# EAGLE design M207 (EAGLE 6.6.0)
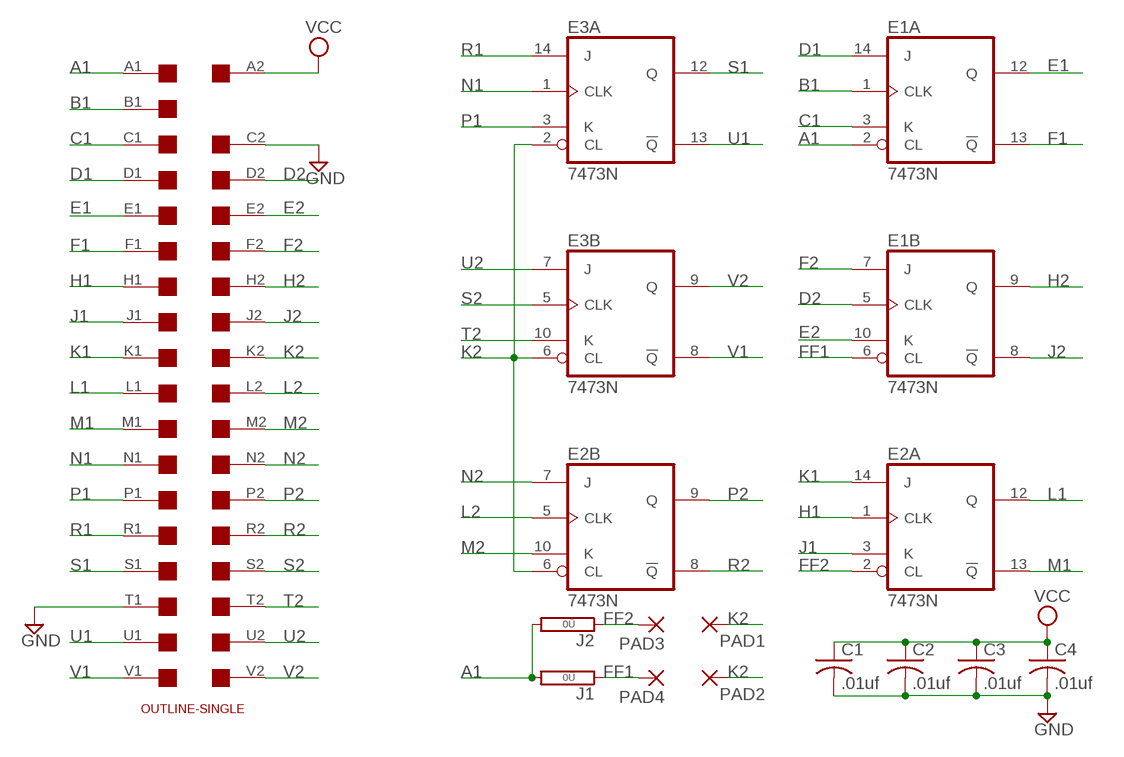
[diagram p0: schematic, sheet 1]

## Parts
C1  .01uf  C-US050-025X075  [C050-025X075]
C2  .01uf  C-US050-025X075  [C050-025X075]
C3  .01uf  C-US050-025X075  [C050-025X075]
C4  .01uf  C-US050-025X075  [C050-025X075]
E1  7473N  74LS73N  [DIL14]
E2  7473N  74LS73N  [DIL14]
E3  7473N  74LS73N  [DIL14]
J1  0R  [0R/10]
J2  0R  [0R/10]
PAD1  1,6/0,8  [1,6/0,8]
PAD2  1,6/0,8  [1,6/0,8]
PAD3  1,6/0,8  [1,6/0,8]
PAD4  1,6/0,8  [1,6/0,8]
U$1  SINGLE  [EDGE-CON2]
U$4  OUTLINE-SINGLE  [SINGLE]

## Nets
A1: E1.2(A:CL) J1.2 J2.2 U$1.A1
B1: E1.1(A:CLK) U$1.B1
C1: E1.3(A:K) U$1.C1
D1: E1.14(A:J) U$1.D1
D2: E1.5(B:CLK) U$1.D2
E1: E1.12(A:Q) U$1.E1
E2: E1.10(B:K) U$1.E2
F1: E1.13(A:!Q) U$1.F1
F2: E1.7(B:J) U$1.F2
FF1: E1.6(B:CL) J1.1 PAD4.1(P)
FF2: E2.2(A:CL) J2.1 PAD3.1(P)
GND: C1.2 C2.2 C3.2 C4.2 U$1.C2 U$1.T1
H1: E2.1(A:CLK) U$1.H1
H2: E1.9(B:Q) U$1.H2
J1: E2.3(A:K) U$1.J1
J2: E1.8(B:!Q) U$1.J2
K1: E2.14(A:J) U$1.K1
K2: E2.6(B:CL) E3.2(A:CL) E3.6(B:CL) PAD1.1(P) PAD2.1(P) U$1.K2
L1: E2.12(A:Q) U$1.L1
L2: E2.5(B:CLK) U$1.L2
M1: E2.13(A:!Q) U$1.M1
M2: E2.10(B:K) U$1.M2
N1: E3.1(A:CLK) U$1.N1
N2: E2.7(B:J) U$1.N2
P1: E3.3(A:K) U$1.P1
P2: E2.9(B:Q) U$1.P2
R1: E3.14(A:J) U$1.R1
R2: E2.8(B:!Q) U$1.R2
S1: E3.12(A:Q) U$1.S1
S2: E3.5(B:CLK) U$1.S2
T2: E3.10(B:K) U$1.T2
U1: E3.13(A:!Q) U$1.U1
U2: E3.7(B:J) U$1.U2
V1: E3.8(B:!Q) U$1.V1
V2: E3.9(B:Q) U$1.V2
VCC: C1.1 C2.1 C3.1 C4.1 U$1.A2
Unconnected: U$1.B2

## Power pins joined to a net without a drawn wire
GND: E1.11(P:GND) E2.11(P:GND) E3.11(P:GND)
VCC: E1.4(P:VCC) E2.4(P:VCC) E3.4(P:VCC)

## Library data of the parts
C1-C4 = rcl:C-US: CAPACITOR, American symbol
E1-E3 = 74xx-us:74*73: Dual J-K FLIP FLOP, clear
J1 J2 = jumper:0R: Bridge 0R 10mm
PAD1-PAD4 = wirepad:1,6/0,8: THROUGH-HOLE PAD
U$1 = dec-con:SINGLE: Single-Height DEC board
U$4 = dec-con:OUTLINE-*: Board outlines for DEC boards.

## Board
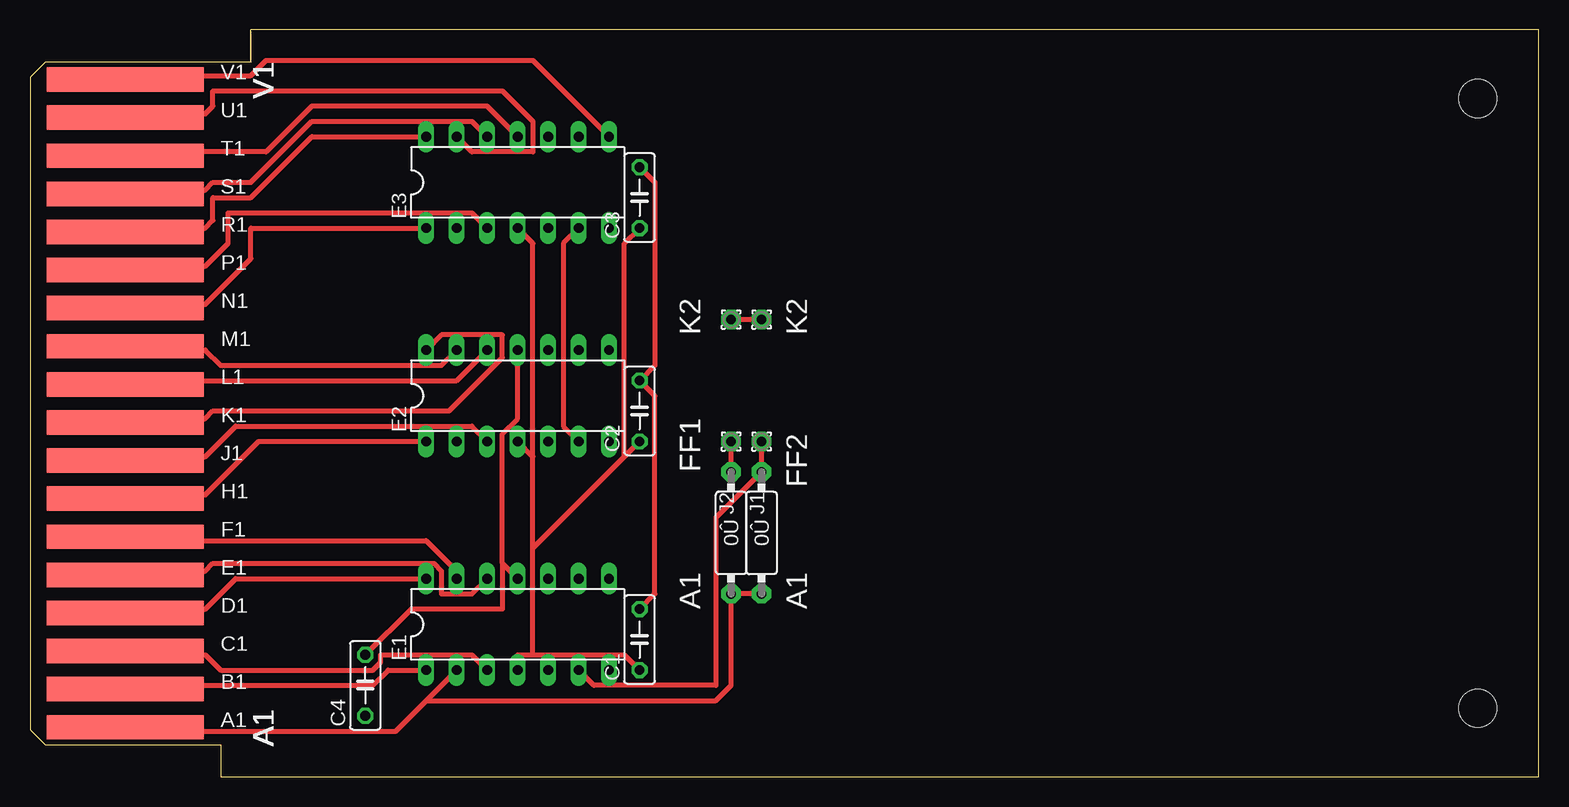
[diagram p1: board, top side]
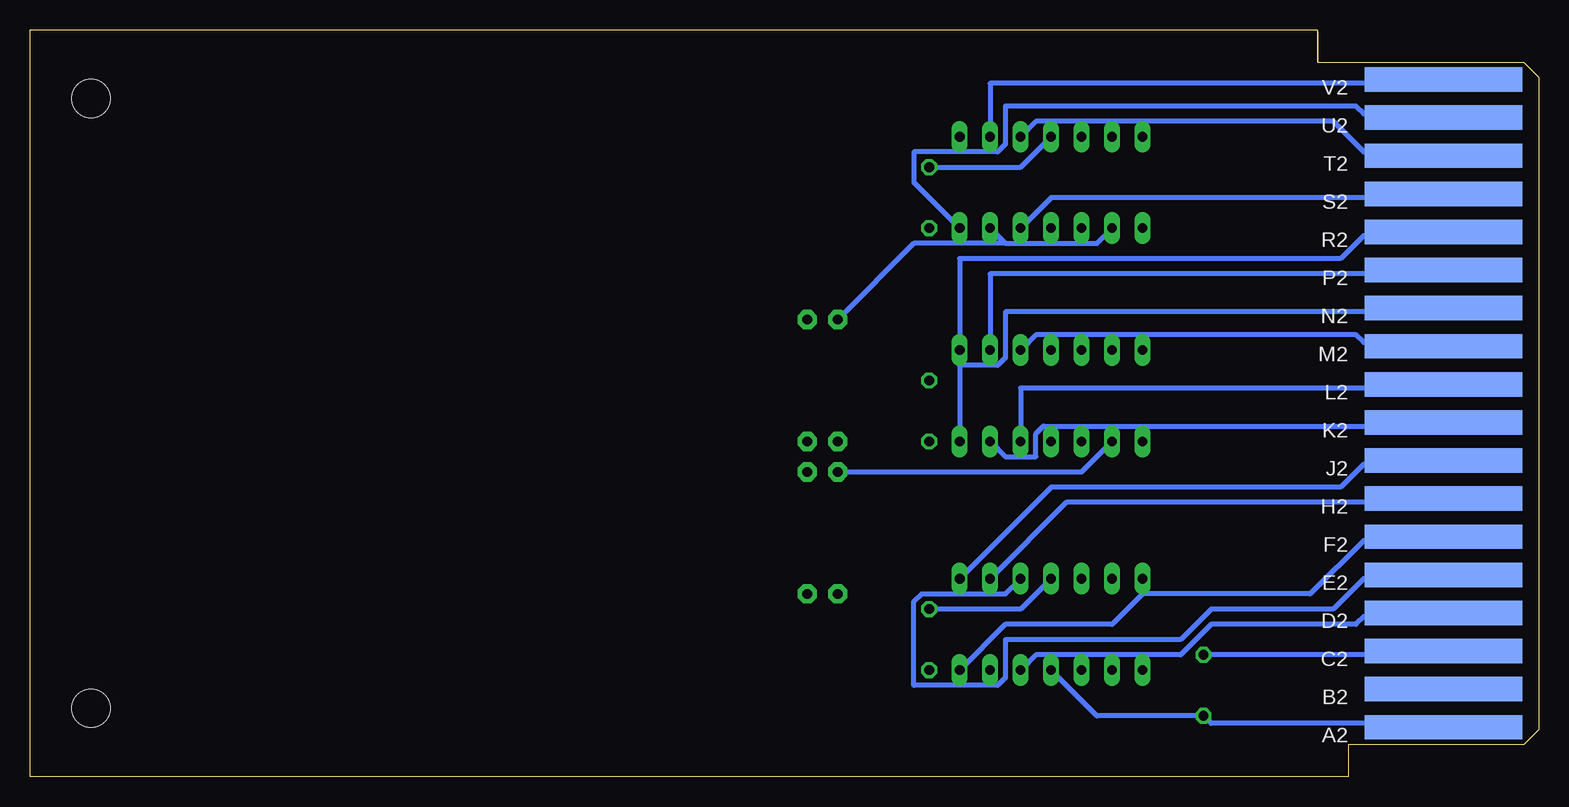
[diagram p2: board, bottom side, seen from below]

Size 125.73 x 62.23 mm. Coordinates in mm from the lower left corner, seen from the top.
Copper layers (1+16): Top 0.035mm / dielectric 1.5mm / Bottom 0.035mm
Design rules "16mils": minimum track width 16mil, minimum drill 32mil, track to track 15mil, track to pad 10mil, pad to pad 10mil, via to via 10mil, smd to smd 10mil, copper to edge 13mil, drill to drill 10mil, minimum pad ring 10mil, minimum via ring 8mil, stop-mask expansion 0mil, vias tented up to drill 0mil, thermal gap 10mil

### Footprints (pad centres in the part's own frame; a part is rotated, then mirrored left to right if it is on the bottom)
C050-025X075 = drill 0.813 octagon: 1 -2.54,0; 2 2.54,0
DIL14 = drill 0.813 long: 1 -7.62,-3.81; 2 -5.08,-3.81; 3 -2.54,-3.81; 4 0,-3.81; 5 2.54,-3.81; 6 5.08,-3.81; 7 7.62,-3.81; 8 7.62,3.81; 9 5.08,3.81; 10 2.54,3.81; 11 0,3.81; 12 -2.54,3.81; 13 -5.08,3.81; 14 -7.62,3.81
0R/10 = drill 0.813 pad 1.6 octagon: 1 -5.08,0; 2 5.08,0
1,6/0,8 = drill 0.813 pad 1.6 octagon: 1 0,0
EDGE-CON2 = smd 13.106 x 2.032: A1 7.938,4.128; B1 7.938,7.303; C1 7.938,10.477; D1 7.938,13.652; E1 7.938,16.828; F1 7.938,20.003; H1 7.938,23.177; J1 7.938,26.352; K1 7.938,29.527; L1 7.938,32.703; M1 7.938,35.877; N1 7.938,39.053; P1 7.938,42.227; R1 7.938,45.403; S1 7.938,48.578; T1 7.938,51.752; U1 7.938,54.928; V1 7.938,58.102 | smd 13.106 x 2.032 bottom: A2 7.938,4.128; B2 7.938,7.303; C2 7.938,10.477; D2 7.938,13.652; E2 7.938,16.828; F2 7.938,20.003; H2 7.938,23.177; J2 7.938,26.352; K2 7.938,29.527; L2 7.938,32.703; M2 7.938,35.877; N2 7.938,39.053; P2 7.938,42.227; R2 7.938,45.403; S2 7.938,48.578; T2 7.938,51.752; U2 7.938,54.928; V2 7.938,58.102
SINGLE = hole 3.175: 120.65,56.515; 120.65,5.715

### Placement (x,y rotation side)
C1  50.8,11.43 90 top
C2  50.8,30.48 90 top
C3  50.8,48.26 90 top
C4  27.94,7.62 90 top
E1  40.64,12.7 0 top
E2  40.64,31.75 0 top
E3  40.64,49.53 0 top
J1  60.96,20.32 270 top
J2  58.42,20.32 270 top
PAD1  58.42,38.1 90 top
PAD2  60.96,38.1 90 top
PAD3  58.42,27.94 90 top
PAD4  60.96,27.94 90 top
U$1  0,0 0 top
U$4  0,0 0 top

### Tracks (layer width: path | path; a pad name or v marks a point on that pad's centre or on a via)
A1
  Top 0.406: J1.2 J2.2 58.42,7.62 57.15,6.35 33.02,6.35 | 33.02,6.35 30.48,3.81 8.26,3.81 U$1.A1 | 33.02,6.35 E1.2
B1
  Top 0.406: E1.1 29.85,8.89 28.58,7.62 8.26,7.62 U$1.B1
C1
  Top 0.406: E1.3 36.83,10.16 29.21,10.16 29.21,9.53 28.58,8.89 15.88,8.89 14.61,10.16 8.26,10.16 U$1.C1
D1
  Top 0.406: E1.14 17.15,16.51 14.61,13.97 8.26,13.97 U$1.D1
D2
  Bottom 0.406: E1.5 41.91,10.16 29.85,10.16 27.31,12.7 15.24,12.7 14.61,13.34 8.26,13.34 U$1.D2
E1
  Top 0.406: E1.12 36.83,15.24 34.29,15.24 34.29,17.14 33.66,17.78 15.24,17.78 14.61,17.14 8.26,17.14 U$1.E1
E2
  Bottom 0.406: E1.10 44.45,15.24 51.44,15.24 52.07,14.61 52.07,7.62 45.09,7.62 44.45,8.26 44.45,11.43 29.85,11.43 27.31,13.97 17.15,13.97 14.61,16.51 8.26,16.51 U$1.E2
F1
  Top 0.406: E1.13 35.56,17.14 33.02,19.68 8.26,19.68 U$1.F1
F2
  Bottom 0.406: E1.7 44.45,12.7 35.56,12.7 33.02,15.24 19.05,15.24 14.61,19.68 8.26,19.68 U$1.F2
FF1
  Top 0.406: E1.6 46.99,7.62 57.15,7.62 57.15,21.59 J1.1 PAD4.1
FF2
  Top 0.406: J2.1 PAD3.1
  Bottom 0.406: E2.2 38.1,25.4 J2.1
GND
  Top 0.406: C3.2 52.07,49.53 52.07,34.29 C2.2 52.07,31.75 52.07,15.24 C1.2 | E2.11 40.64,29.84 39.37,28.57 39.37,17.78 | E1.11 39.37,17.78 | E3.11 38.1,55.88 23.5,55.88 19.69,52.07 8.26,52.07 U$1.T1 | C4.2 31.75,13.97 39.37,13.97 39.37,17.78
  Bottom 0.406: C4.2 8.26,10.16 U$1.C2 | E3.11 43.18,50.8 C3.2 | C1.2 43.18,13.97 E1.11
H1
  Top 0.406: E2.1 19.05,27.94 14.61,23.5 8.26,23.5 U$1.H1
H2
  Bottom 0.406: E1.9 39.37,22.86 8.26,22.86 U$1.H2
J1
  Top 0.406: E2.3 36.83,29.21 17.15,29.21 14.61,26.67 8.26,26.67 U$1.J1
J2
  Bottom 0.406: E1.8 40.64,24.13 16.51,24.13 14.61,26.04 8.26,26.04 U$1.J2
K1
  Top 0.406: E2.14 34.29,36.83 39.37,36.83 39.37,34.92 34.93,30.48 15.24,30.48 14.61,29.84 8.26,29.84 U$1.K1
K2
  Top 0.406: PAD2.1 PAD1.1 | E2.6 44.45,29.21 44.45,44.45 E3.6
  Bottom 0.406: E3.2 36.83,44.45 44.45,44.45 | E3.6 44.45,44.45 | PAD1.1 52.07,44.45 44.45,44.45 | E2.6 44.45,26.67 41.91,26.67 41.91,28.57 41.28,29.21 8.26,29.21 U$1.K2
L1
  Top 0.406: E2.12 35.56,33.02 8.26,33.02 U$1.L1
L2
  Bottom 0.406: E2.5 43.18,32.38 8.26,32.38 U$1.L2
M1
  Top 0.406: E2.13 34.29,34.29 15.88,34.29 14.61,35.56 8.26,35.56 U$1.M1
M2
  Bottom 0.406: E2.10 41.91,36.83 15.24,36.83 14.61,36.2 8.26,36.2 U$1.M2
N1
  Top 0.406: E3.1 18.42,45.72 18.42,43.18 14.61,39.37 8.26,39.37 U$1.N1
N2
  Bottom 0.406: E2.7 48.26,34.29 45.09,34.29 44.45,34.92 44.45,38.73 8.26,38.73 U$1.N2
P1
  Top 0.406: E3.3 36.83,46.99 16.51,46.99 16.51,44.45 14.61,42.55 8.26,42.55 U$1.P1
P2
  Bottom 0.406: E2.9 45.72,41.91 8.26,41.91 U$1.P2
R1
  Top 0.406: E3.14 23.5,53.34 18.42,48.26 15.24,48.26 15.24,46.35 14.61,45.72 8.26,45.72 U$1.R1
R2
  Bottom 0.406: E2.8 48.26,43.18 16.51,43.18 14.61,45.09 8.26,45.09 U$1.R2
S1
  Top 0.406: E3.12 36.83,54.61 23.5,54.61 18.42,49.53 15.24,49.53 14.61,48.9 8.26,48.9 U$1.S1
S2
  Bottom 0.406: E3.5 40.64,48.26 8.26,48.26 U$1.S2
T2
  Bottom 0.406: E3.10 41.91,54.61 17.15,54.61 14.61,52.07 8.26,52.07 U$1.T2
U1
  Top 0.406: E3.13 36.83,52.07 41.91,52.07 41.91,54.61 39.37,57.15 15.24,57.15 15.24,55.88 14.61,55.24 8.26,55.24 U$1.U1
U2
  Bottom 0.406: E3.7 52.07,49.53 52.07,52.07 45.09,52.07 44.45,52.7 44.45,55.88 15.24,55.88 14.61,55.24 8.26,55.24 U$1.U2
V1
  Top 0.406: E3.8 41.91,59.69 19.69,59.69 18.42,58.42 8.26,58.42 U$1.V1
V2
  Bottom 0.406: E3.9 45.72,57.78 8.26,57.78 U$1.V2
VCC
  Top 0.406: C1.1 49.53,10.16 41.91,10.16 | 41.91,10.16 40.64,10.16 E1.4 | 41.91,26.67 E2.4 | 41.91,10.16 41.91,19.05 | 41.91,19.05 41.91,26.67 | 41.91,19.05 49.53,26.67 | 49.53,26.67 C2.1 | E3.4 41.91,44.45 41.91,26.67 | C3.1 49.53,44.45 49.53,26.67
  Bottom 0.406: U$1.A2 8.26,4.45 27.31,4.45 C4.1 36.83,5.08 E1.4

### Text on the board
tPlace: K2 | K2 | FF1 | FF2 | A1 | A1
tNames: V1 | V1 | V1 | V1 | V1 | V1 | V1 | V1 | V1 | V1 | V1 | V1 | V1 | V1 | V1 | V1 | V1 | V1 | V1 | V1 | V1 | V1 | V1 | V1 | V1 | V1 | V1 | V1 | V1 | V1 | V1 | V1 | A1 | A1 | A1 | A1 | A1 | A1 | A1 | A1 | A1 | A1 | A1 | A1 | A1 | A1 | A1 | A1 | A1 | A1 | A1 | A1 | A1 | A1 | A1 | A1 | A1 | A1 | A1 | A1 | A1 | A1 | A1 | A1